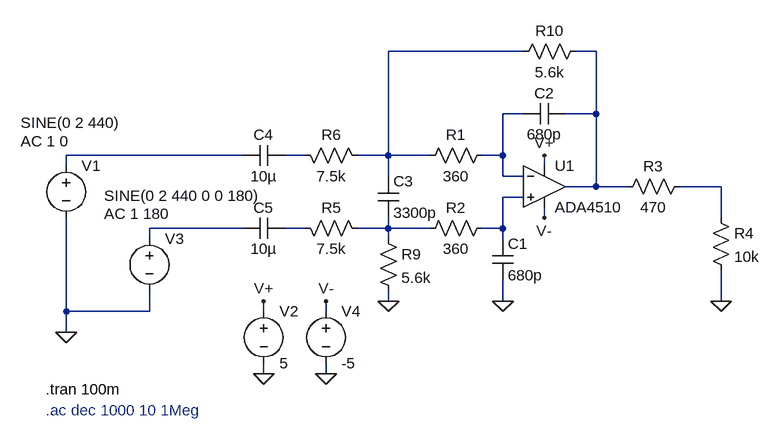
[diagram p0: schematic DeltaSigma-OutputFilter.asc]
DeltaSigma-OutputFilter.asc, the LTspice schematic file:
Version 4
SHEET 1 880 1060
WIRE 416 -32 208 -32
WIRE 528 -32 496 -32
WIRE 416 64 384 64
WIRE 528 64 528 -32
WIRE 528 64 480 64
WIRE -16 128 -288 128
WIRE 80 128 48 128
WIRE 208 128 208 -32
WIRE 208 128 160 128
WIRE 272 128 208 128
WIRE 384 128 384 64
WIRE 384 128 352 128
WIRE -288 144 -288 128
WIRE 448 144 448 128
WIRE 208 160 208 128
WIRE 384 160 384 128
WIRE 416 160 384 160
WIRE 528 176 528 64
WIRE 528 176 480 176
WIRE 576 176 528 176
WIRE 720 176 656 176
WIRE 416 192 384 192
WIRE 448 224 448 208
WIRE 720 224 720 176
WIRE -16 240 -160 240
WIRE 80 240 48 240
WIRE 208 240 208 224
WIRE 208 240 160 240
WIRE 272 240 208 240
WIRE 384 240 384 192
WIRE 384 240 352 240
WIRE -160 256 -160 240
WIRE 208 256 208 240
WIRE 384 256 384 240
WIRE 208 352 208 336
WIRE 384 352 384 320
WIRE 720 352 720 304
WIRE -288 368 -288 224
WIRE -160 368 -160 336
WIRE -160 368 -288 368
WIRE 16 368 16 352
WIRE 112 368 112 352
WIRE -288 400 -288 368
WIRE 16 464 16 448
WIRE 112 464 112 448
FLAG 16 464 0
FLAG 16 352 V+
FLAG 448 128 V+
FLAG 720 352 0
FLAG 384 352 0
FLAG 208 352 0
FLAG -288 400 0
FLAG 448 224 V-
FLAG 112 464 0
FLAG 112 352 V-
SYMBOL voltage -288 128 R0
WINDOW 3 -70 -50 Left 2
WINDOW 123 -70 -22 Left 2
WINDOW 39 0 0 Left 0
SYMATTR Value SINE(0 2 440)
SYMATTR Value2 AC 1 0
SYMATTR InstName V1
SYMBOL voltage 16 352 R0
WINDOW 123 0 0 Left 0
WINDOW 39 0 0 Left 0
SYMATTR InstName V2
SYMATTR Value 5
SYMBOL OpAmps\\ADA4510 448 112 R0
SYMATTR InstName U1
SYMBOL res 368 112 R90
WINDOW 0 0 56 VBottom 2
WINDOW 3 32 56 VTop 2
SYMATTR InstName R1
SYMATTR Value 360
SYMBOL res 368 224 R90
WINDOW 0 0 56 VBottom 2
WINDOW 3 32 56 VTop 2
SYMATTR InstName R2
SYMATTR Value 360
SYMBOL cap 368 256 R0
SYMATTR InstName C1
SYMATTR Value 680p
SYMBOL cap 480 48 R90
WINDOW 0 0 32 VBottom 2
WINDOW 3 32 32 VTop 2
SYMATTR InstName C2
SYMATTR Value 680p
SYMBOL res 672 160 R90
WINDOW 0 0 56 VBottom 2
WINDOW 3 32 56 VTop 2
SYMATTR InstName R3
SYMATTR Value 470
SYMBOL res 704 208 R0
SYMATTR InstName R4
SYMATTR Value 10k
SYMBOL cap 192 160 R0
SYMATTR InstName C3
SYMATTR Value 3300p
SYMBOL res 64 224 M90
WINDOW 0 0 56 VBottom 2
WINDOW 3 32 56 VTop 2
SYMATTR InstName R5
SYMATTR Value 7.5k
SYMBOL res 64 112 M90
WINDOW 0 0 56 VBottom 2
WINDOW 3 32 56 VTop 2
SYMATTR InstName R6
SYMATTR Value 7.5k
SYMBOL cap 48 112 R90
WINDOW 0 0 32 VBottom 2
WINDOW 3 32 32 VTop 2
SYMATTR InstName C4
SYMATTR Value 10µ
SYMBOL cap 48 224 R90
WINDOW 0 0 32 VBottom 2
WINDOW 3 32 32 VTop 2
SYMATTR InstName C5
SYMATTR Value 10µ
SYMBOL res 192 240 R0
SYMATTR InstName R9
SYMATTR Value 5.6k
SYMBOL res 512 -48 R90
WINDOW 0 0 56 VBottom 2
WINDOW 3 32 56 VTop 2
SYMATTR InstName R10
SYMATTR Value 5.6k
SYMBOL voltage -160 240 R0
WINDOW 3 -70 -50 Left 2
WINDOW 123 -70 -22 Left 2
WINDOW 39 0 0 Left 0
SYMATTR Value SINE(0 2 440 0 0 180)
SYMATTR Value2 AC 1 180
SYMATTR InstName V3
SYMBOL voltage 112 352 R0
WINDOW 123 0 0 Left 0
WINDOW 39 0 0 Left 0
SYMATTR InstName V4
SYMATTR Value -5
TEXT -320 488 Left 2 !.tran 100m
TEXT -320 520 Left 2 ;.ac dec 1000 10 1Meg

The netlist it stands for:
* DeltaSigma-OutputFilter.asc
V1 N004 0 SINE(0 2 440) AC 1 0
V2 V+ 0 5
XU1 N007 N003 V+ V- N002 ADA4510  ; pins In+ In- V+ V- OUT
R1 N003 N001 360
R2 N007 N010 360
C1 N007 0 680p
C2 N002 N003 680p
R3 N006 N002 470
R4 N006 0 10k
C3 N001 N010 3300p
R5 N009 N010 7.5k
R6 N005 N001 7.5k
C4 N005 N004 10µ
C5 N009 N008 10µ
R9 N010 0 5.6k
R10 N002 N001 5.6k
V3 N008 0 SINE(0 2 440 0 0 180) AC 1 180
V4 V- 0 -5
.tran 100m
* .ac dec 1000 10 1Meg
.backanno
.end